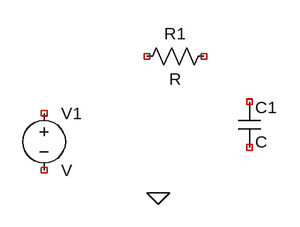
[diagram p0: schematic Draft2.asc]
Draft2.asc, the LTspice schematic file:
Version 4
SHEET 1 880 680
FLAG 144 272 0
SYMBOL voltage -16 144 R0
SYMATTR InstName V1
SYMBOL res 224 64 R90
WINDOW 0 0 56 VBottom 2
WINDOW 3 32 56 VTop 2
SYMATTR InstName R1
SYMBOL cap 256 144 R0
SYMATTR InstName C1

The netlist it stands for:
* Draft2.asc
V1 NC_01 NC_02 V
R1 NC_03 NC_04 R
C1 NC_05 NC_06 C
.backanno
.end